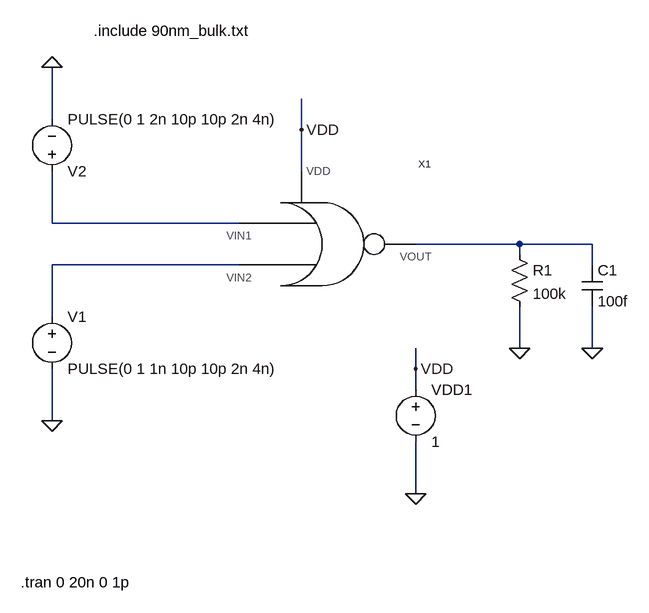
[diagram p0: schematic NOR_tb.asc]
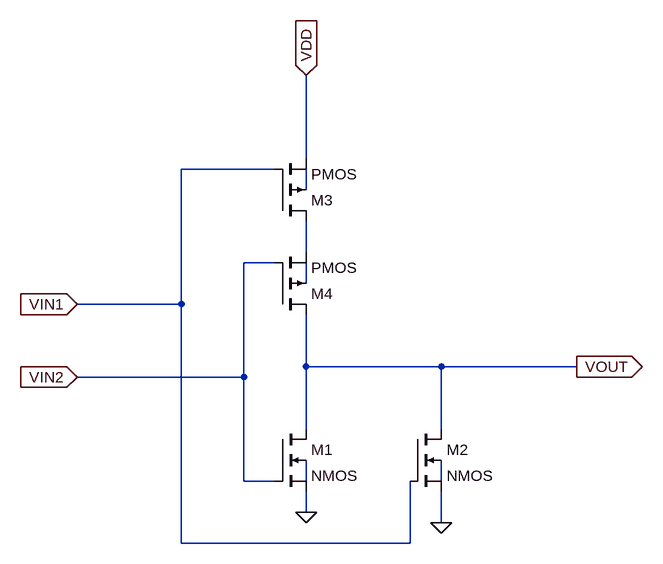
[diagram p1: sub-circuit nor.asc]
NOR_tb.asc, the LTspice schematic file:
Version 4
SHEET 1 880 680
WIRE -240 -64 -240 -144
WIRE 144 -48 144 -96
WIRE 144 16 144 -48
WIRE -240 96 -240 16
WIRE 48 96 -240 96
WIRE 480 128 320 128
WIRE 592 128 480 128
WIRE 480 144 480 128
WIRE 48 160 -240 160
WIRE 592 160 592 128
WIRE -240 240 -240 160
WIRE 480 288 480 224
WIRE 592 288 592 224
WIRE 320 320 320 288
WIRE 320 352 320 320
WIRE -240 400 -240 320
WIRE 320 512 320 432
FLAG 320 512 0
FLAG 320 320 VDD
FLAG 480 288 0
FLAG 592 288 0
FLAG 144 -48 VDD
FLAG -240 400 0
FLAG -240 -144 0
SYMBOL voltage -240 224 R0
WINDOW 123 0 0 Left 0
WINDOW 39 0 0 Left 0
SYMATTR InstName V1
SYMATTR Value PULSE(0 1 1n 10p 10p 2n 4n)
SYMBOL res 464 128 R0
SYMATTR InstName R1
SYMATTR Value 100k
SYMBOL cap 576 160 R0
SYMATTR InstName C1
SYMATTR Value 100f
SYMBOL voltage 320 336 R0
WINDOW 123 0 0 Left 0
WINDOW 39 0 0 Left 0
SYMATTR InstName VDD1
SYMATTR Value 1
SYMBOL voltage -240 32 M180
WINDOW 123 0 0 Left 0
WINDOW 39 0 0 Left 0
SYMATTR InstName V2
SYMATTR Value PULSE(0 1 2n 10p 10p 2n 4n)
SYMBOL NOR 160 128 R0
SYMATTR InstName X1
TEXT -176 -200 Left 2 !.include 90nm_bulk.txt
TEXT -288 648 Left 2 !.tran 0 20n 0 1p

nor.asc, the sub-circuit schematic file:
Version 4
SHEET 1 992 680
WIRE 352 -64 352 -192
WIRE 304 -48 160 -48
WIRE 352 -16 352 -48
WIRE 352 80 352 32
WIRE 304 96 256 96
WIRE 352 128 352 96
WIRE 160 160 160 -48
WIRE 160 160 0 160
WIRE 352 256 352 176
WIRE 560 256 352 256
WIRE 768 256 560 256
WIRE 256 272 256 96
WIRE 256 272 0 272
WIRE 352 352 352 256
WIRE 560 352 560 256
WIRE 256 432 256 272
WIRE 304 432 256 432
WIRE 352 432 352 400
WIRE 560 432 560 400
WIRE 352 480 352 448
WIRE 560 496 560 448
WIRE 160 528 160 160
WIRE 512 528 512 432
WIRE 512 528 160 528
FLAG 352 480 0
FLAG 560 496 0
FLAG 0 160 VIN1
IOPIN 0 160 In
FLAG 0 272 VIN2
IOPIN 0 272 In
FLAG 352 -192 VDD
IOPIN 352 -192 In
FLAG 768 256 VOUT
IOPIN 768 256 Out
SYMBOL nmos4 304 352 R0
SYMATTR InstName M1
SYMATTR Value2 l=90n w=200n
SYMBOL nmos4 512 352 R0
SYMATTR InstName M2
SYMATTR Value2 l=90n w=200n
SYMBOL pmos4 304 32 M180
SYMATTR InstName M3
SYMATTR Value2 l=90n w=400n
SYMBOL pmos4 304 176 M180
SYMATTR InstName M4
SYMATTR Value2 l=90n w=400n

The netlist it stands for:
* NOR_tb.asc
V1 N003 0 PULSE(0 1 1n 10p 10p 2n 4n)
R1 N002 0 100k
C1 N002 0 100f
VDD1 VDD 0 1
V2 N001 0 PULSE(0 1 2n 10p 10p 2n 4n)
XX1 VDD N001 N002 N003 nor

* block symbol definitions
.subckt nor VDD VIN1 VOUT VIN2
M1 VOUT VIN2 0 N004 NMOS l=90n w=200n
M2 VOUT VIN1 0 N005 NMOS l=90n w=200n
M3 N002 VIN1 VDD N001 PMOS l=90n w=400n
M4 VOUT VIN2 N002 N003 PMOS l=90n w=400n
.ends nor

.model NMOS NMOS
.model PMOS PMOS
.lib standard.mos
.include 90nm_bulk.txt
.tran 0 20n 0 1p
.backanno
.end